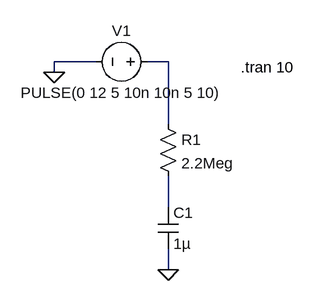
[diagram p0: schematic SHDN21-CHRG-LTSpiceSimulation.asc]
SHDN21-CHRG-LTSpiceSimulation.asc, the LTspice schematic file:
Version 4
SHEET 1 880 680
WIRE -80 -96 -144 -96
WIRE 32 -96 0 -96
WIRE -144 -80 -144 -96
WIRE 32 0 32 -96
WIRE 32 128 32 80
WIRE 32 224 32 192
FLAG 32 224 0
FLAG -144 -80 0
DATAFLAG 32 96 ""
SYMBOL res 16 -16 R0
SYMATTR InstName R1
SYMATTR Value 2.2Meg
SYMATTR SpiceLine tol=5 pwr=0.25
SYMBOL cap 16 128 R0
SYMATTR InstName C1
SYMATTR Value 1µ
SYMBOL voltage 16 -96 R90
WINDOW 0 -32 56 VBottom 2
WINDOW 3 32 56 VTop 2
WINDOW 123 0 0 Left 0
WINDOW 39 0 0 Left 0
SYMATTR InstName V1
SYMATTR Value PULSE(0 12 5 10n 10n 5 10)
TEXT 144 -88 Left 2 !.tran 10

The netlist it stands for:
* SHDN21-CHRG-LTSpiceSimulation.asc
R1 N001 N002 2.2Meg tol=5 pwr=0.25
C1 N002 0 1µ
V1 N001 0 PULSE(0 12 5 10n 10n 5 10)
.tran 10
.backanno
.end